# EasyEDA Pro project 25工创PCB.eprj, schematic 云台顶部分线板原理图
Board Name: 云台顶部分线板; Create Date: 2025-02-27; Page Name: P1; Project Name: 25工创PCB; Schematic Name: 云台顶部分线板原理图; Update Date: 2025-03-11; Company: 嘉立创EDA; Page Size: A4; Version: V1.0
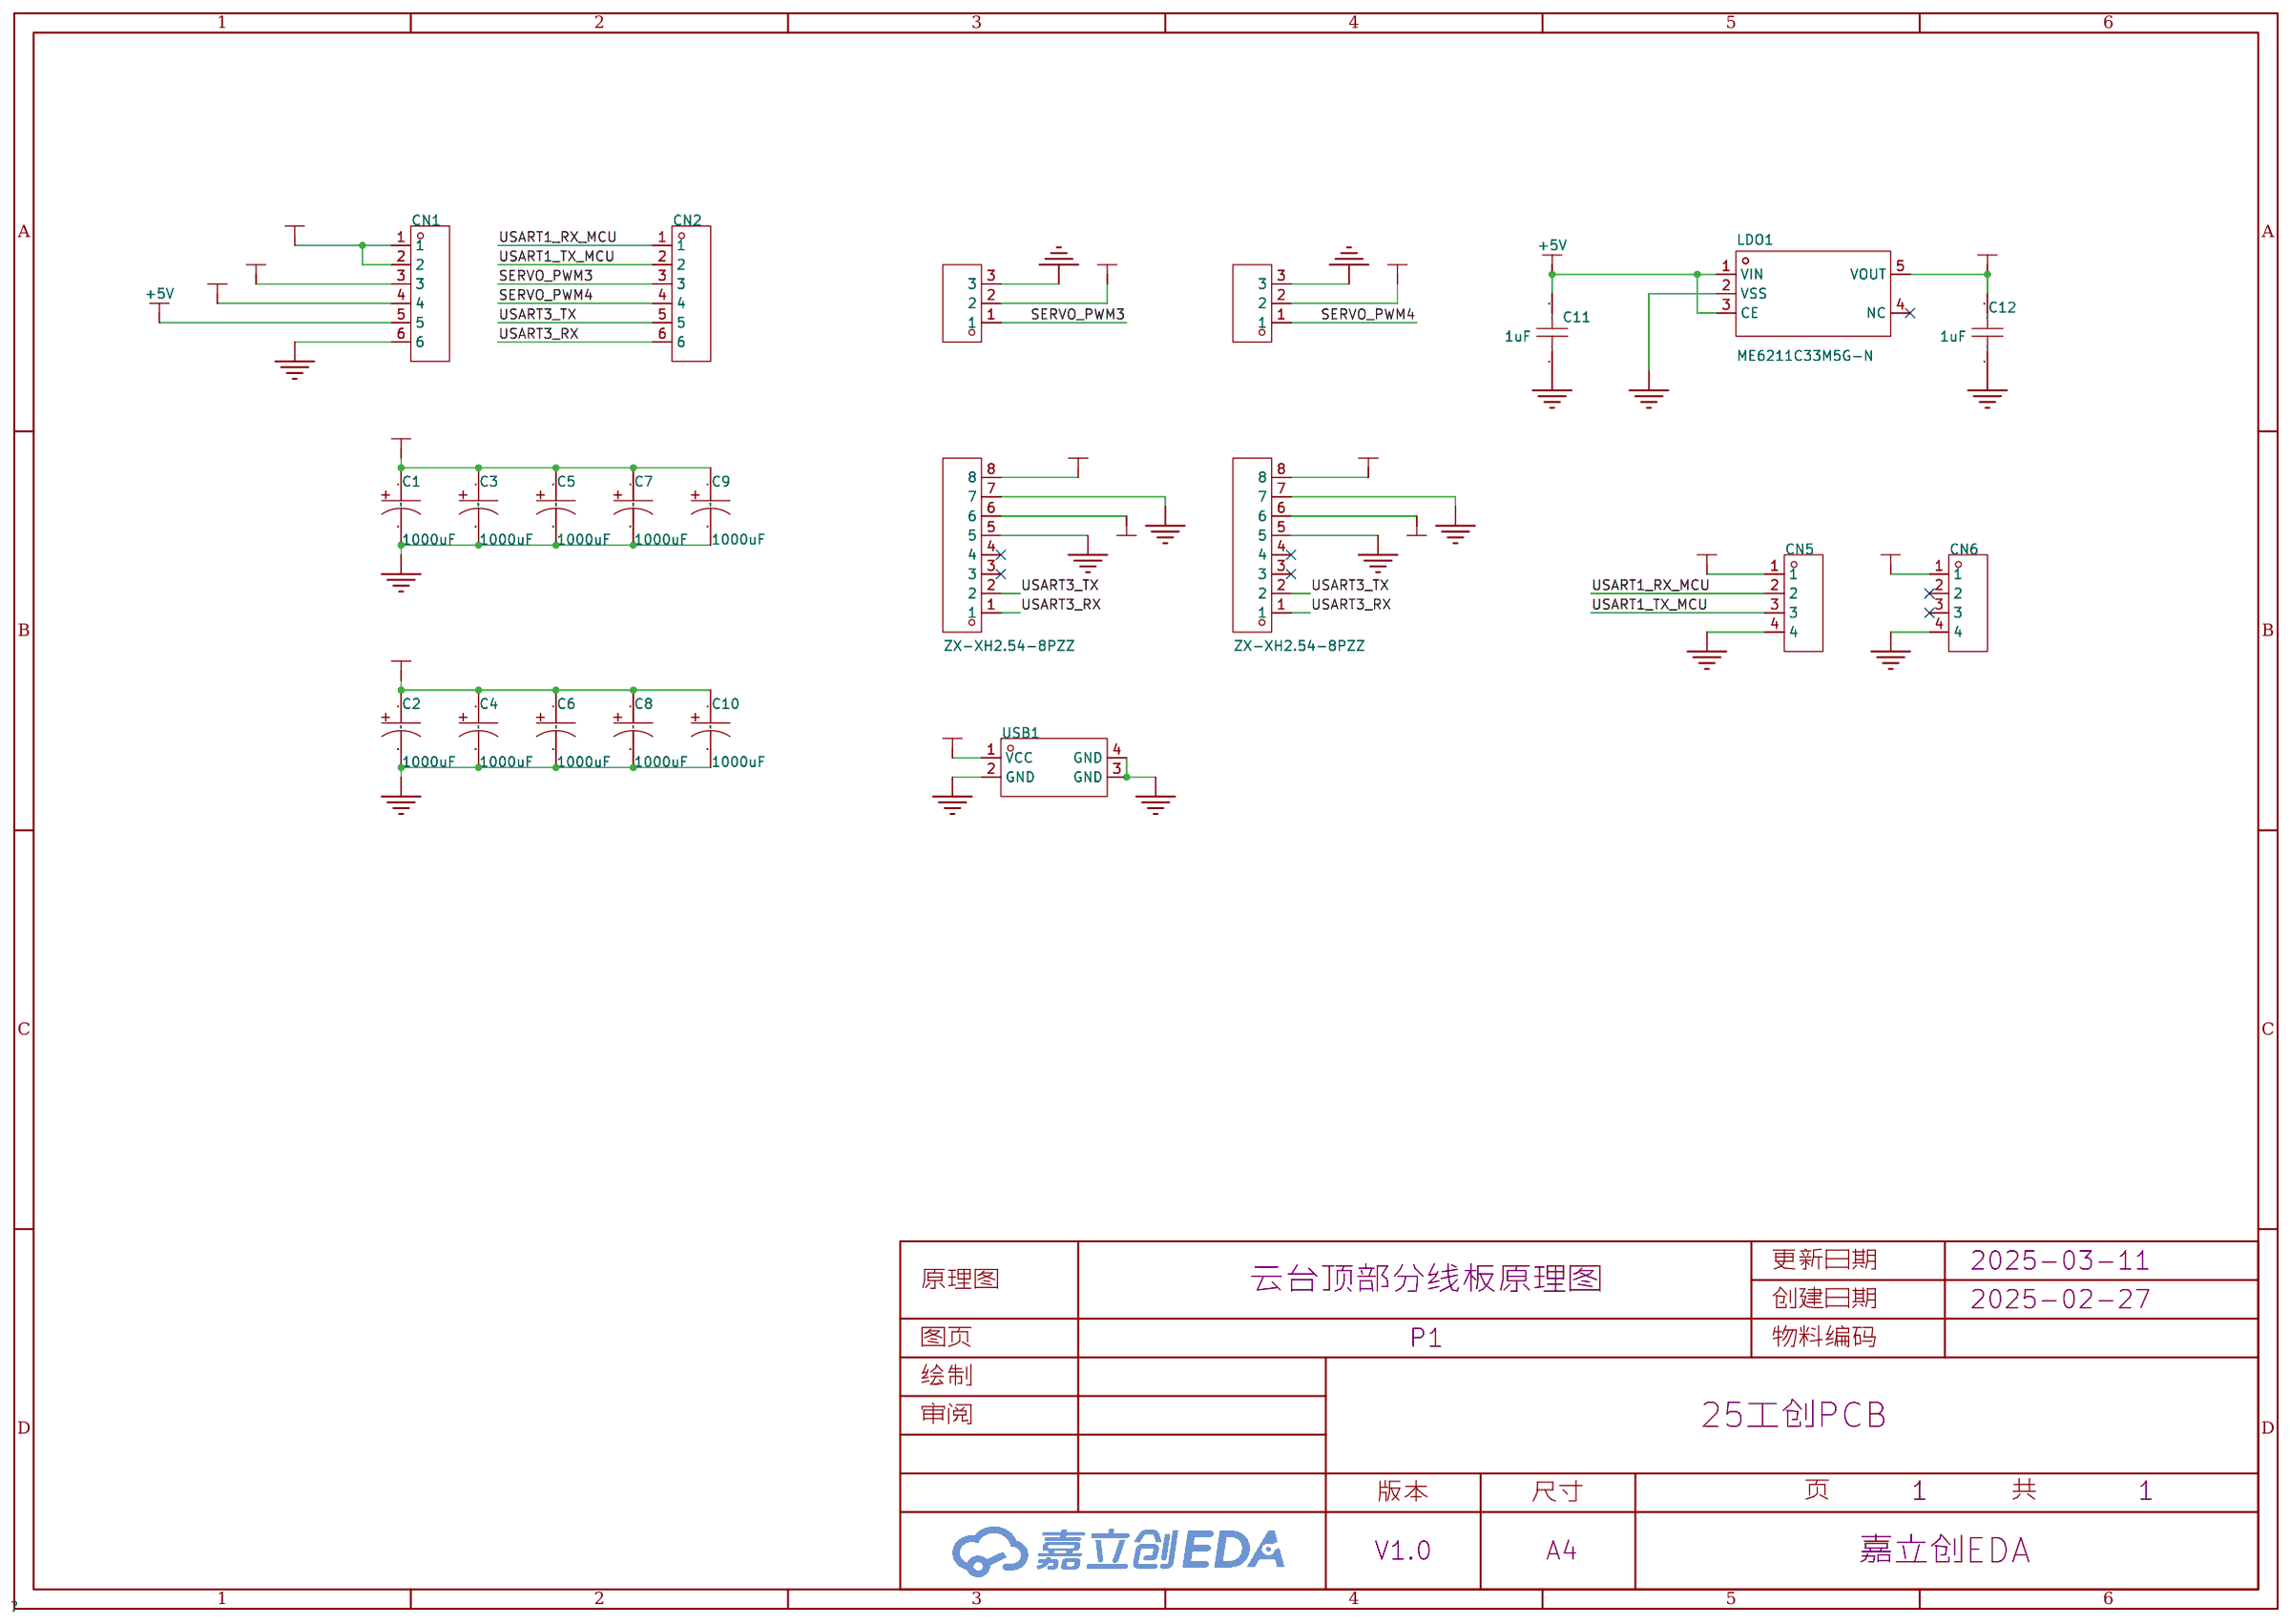
[diagram p5: schematic sheet]

## Parts
C1  680uF  [CAP-SMD_BD10.0-L10.3-W10.3-LS11.3-FD]
C2  680uF  [CAP-SMD_BD10.0-L10.3-W10.3-LS11.3-FD]
C3  680uF  [CAP-SMD_BD10.0-L10.3-W10.3-LS11.3-FD]
C4  680uF  [CAP-SMD_BD10.0-L10.3-W10.3-LS11.3-FD]
C5  680uF  [CAP-SMD_BD10.0-L10.3-W10.3-LS11.3-FD]
C6  680uF  [CAP-SMD_BD10.0-L10.3-W10.3-LS11.3-FD]
C7  680uF  [CAP-SMD_BD10.0-L10.3-W10.3-LS11.3-FD]
C8  680uF  [CAP-SMD_BD10.0-L10.3-W10.3-LS11.3-FD]
C9  680uF  [CAP-SMD_BD10.0-L10.3-W10.3-LS11.3-FD]
C10  680uF  [CAP-SMD_BD10.0-L10.3-W10.3-LS11.3-FD]
C11  1uF  [C0603]
C12  1uF  [C0603]
CN1  WAFER-XH254Z-6A  [CONN-TH_XH2.54-6P]
CN2  WAFER-XH254Z-6A  [CONN-TH_XH2.54-6P]
CN3  ZX-XH2.54-8PZZ  [CONN-TH_8P-P2.50-XH2.54-8P]
CN4  ZX-XH2.54-8PZZ  [CONN-TH_8P-P2.50-XH2.54-8P]
CN5  WAFER-XH254Z-4A  [CONN-TH_XH-4A]
CN6  WAFER-XH254Z-4A  [CONN-TH_XH-4A]
H1  -  [HDR-TH_3P-P2.54-V-M]
H2  -  [HDR-TH_3P-P2.54-V-M]
LDO1  ME6211C33M5G-N  [SOT-23-5_L3.0-W1.7-P0.95-LS2.8-BL]
USB1  HX TYPE-C 2P 180 LCH6.5  [USB-TH_HX-TYPE-C-2P-180-LCH6.8]

## Library data of the parts
C1-C10 = RVT1C681M1010: 容值:680uF;精度:±20%;额定电压:16V;纹波电流:-;等效串联电阻:-;; LCSC Part Name: 680uF ±20% 16V; Supplier Part: C335987; Manufacturer: ROQANG(容强); Supplier Footprint: SMD,D10xL10.2mm; JLCPCB Part Class: Extended Part; Datasheet: https://atta.szlcsc.com/upload/public/pdf/source/20181128/C335987_23CA7AA50FB42690DF736C43FE112376.pdf; Supplier: LCSC; Tolerance: ±20%; Rated Voltage: 16V; φD: 10mm; L: 10.2mm; Lifetime @ Temp: 2000hrs@105; Operating Temperature: -45~+105
C11 C12 = CAP_0603: Supplier Footprint: 0603
CN1 CN2 = WAFER-XH254Z-6A: Supplier Part: C7432686; Manufacturer: HANBO(汉博); Supplier Footprint: 插件,P=2.5mm; JLCPCB Part Class: 扩展库; Datasheet: https://atta.szlcsc.com/upload/public/pdf/source/20230718/3B4FABA5D38EFB02DAF74E7C2B33D98F.pdf; Supplier: LCSC; Pins Structure: 1x6P; Pitch: 2.54mm; Mounting Style: 直插; Reference Series: XH; Number of Pins: 6P; Number of Rows: 1; Number of PINs Per Row: 6; Current Rating (Max): 3A; Operating Temperature Range: -25℃~+85℃
CN3 CN4 = ZX-XH2.54-8PZZ: Supplier Part: C7429638; Manufacturer: Megastar(兆星); Supplier Footprint: 插件,P=2.54mm; JLCPCB Part Class: 扩展库; Datasheet: https://atta.szlcsc.com/upload/public/pdf/source/20230619/688603DEA58996C00B1F33C46797D2C3.pdf; Supplier: LCSC; Pins Structure: 1x8P; Pitch: 2.54mm; Mounting Style: 直插; Reference Series: XH; Number of Pins: 8P; Number of Rows: 1; Number of PINs Per Row: 8; Current Rating (Max): 3A; Contact Material: 黄铜; Contact Plating: 锡; Operating Temperature Range: -25℃~+85℃
CN5 CN6 = WAFER-XH254Z-4A: Supplier Part: C7432684; Manufacturer: HANBO(汉博); Supplier Footprint: 插件,P=2.5mm; JLCPCB Part Class: 扩展库; Datasheet: https://atta.szlcsc.com/upload/public/pdf/source/20230718/3B4FABA5D38EFB02DAF74E7C2B33D98F.pdf; Supplier: LCSC; Pins Structure: 1x4P; Pitch: 2.54mm; Mounting Style: 直插; Reference Series: XH; Number of Pins: 4P; Number of Rows: 1; Number of PINs Per Row: 4; Current Rating (Max): 3A; Operating Temperature Range: -25℃~+85℃
H1 H2 = HDR-M_2.54_1x3P: Supplier Part: C2937625; Supplier Footprint: 插件
LDO1 = ME6211C33M5G-N: 输出类型:固定;最大输入电压:6V;输出电压:3.3V;最大输出电流:500mA;电源纹波抑制比(PSRR):70dB;输出极性:正极;; LCSC Part Name: 输入6V 输出3.3V 500mA; Supplier Part: C82942; Manufacturer: MICRONE(南京微盟); Supplier Footprint: SOT-23-5; JLCPCB Part Class: 扩展库; Datasheet: https://atta.szlcsc.com/upload/public/pdf/source/20170918/C82942_1505727073070976520.pdf; Supplier: LCSC; Output Type: 固定; Maximum Input Voltage: 6V; Output Voltage: 3.3V; MAX Output Current: 500mA; Power Supply Rejection Ratio (PSRR): 70dB; Dropout Voltage: 260mV@(200mA); Output Polarity: 正极; Number of Outputs: 1
USB1 = HX TYPE-C 2P 180 LCH6.5: LCSC Part Name: Type-C 母 直插; Supplier Part: C25168797; Manufacturer: hanxia(韩下); Supplier Footprint: 插件; JLCPCB Part Class: 扩展库; Datasheet: https://atta.szlcsc.com/upload/public/pdf/source/20250106/D3F659E44FAABA5B4CB20F12835B6C82.pdf; Supplier: LCSC; Connector Type: Type-C; Gender: 母; Mounting Type: 直插; Number of Contacts: 2P; Number of Ports: 1; Current Rating-Power: 3A; Voltage Rating: 20V; Connect-Disconnect Life: 5千次; Center Height: 1.68mm; Length: 6.5mm; Detection color: 黑色; Operating Temperature: -30℃~+80℃

## Nets
24V_2: CN1.1 CN1.2 CN3.8 CN4.8
+3V3: C12.2 CN3.6 CN4.6 CN5.1 LDO1.5(VOUT)
+5V: C11.2 CN1.5 CN6.1 LDO1.1(VIN) LDO1.3(CE)
+5V_PI: C1.1 C2.1 C3.1 C4.1 C5.1 C6.1 C7.1 C8.1 C9.1 C10.1 CN1.4 USB1.1(VCC)
+6V: CN1.3 H1.2 H2.2
GND: C1.2 C2.2 C3.2 C4.2 C5.2 C6.2 C7.2 C8.2 C9.2 C10.2 C11.1 C12.1 CN1.6 CN3.5 CN3.7 CN4.5 CN4.7 CN5.4 CN6.4 H1.3 H2.3 LDO1.2(VSS) USB1.2(GND) USB1.3(GND) USB1.4(GND)
SERVO_PWM3: CN2.3 H1.1
SERVO_PWM4: CN2.4 H2.1
USART1_RX_MCU: CN2.1 CN5.2
USART1_TX_MCU: CN2.2 CN5.3
USART3_RX: CN2.6 CN3.1 CN4.1
USART3_TX: CN2.5 CN3.2 CN4.2

Not connected (* = marked no-connect by the designer): CN3 3* 4*; CN4 3* 4*; CN6 2* 3*; LDO1 4(NC)*
